# Altium schematic sheet SAM_E54_Xplained_Pro_CAN.SchDoc: CAN
size A3; Organization: ATMEL Norway; Address1: Vestre Rosten 79; Address2: N-7075 TILLER; Address3: NORWAY; DocumentNumber: A09-2748; Revision: 4; SheetNumber: 6; SheetTotal: 13; PageSetup: Record=PageOptions|CenterHorizontal=True|CenterVertical=True|PrintScale=1.01|XCorrection=1.00|YCorrection=1.00|PrintKind=1|BorderSize=5000000|LeftOffset=0|BottomOffset=0|Orientation=2|PaperLength=1000|PaperWidth=1000|Scale=100|PaperSource=7|PrintQuality=-4|MediaType=1|DitherType=10|PaperKind=A3 (297 x 420 mm)|PrintScaleMode=1; ProjectName: SAM3X Xplained Pro
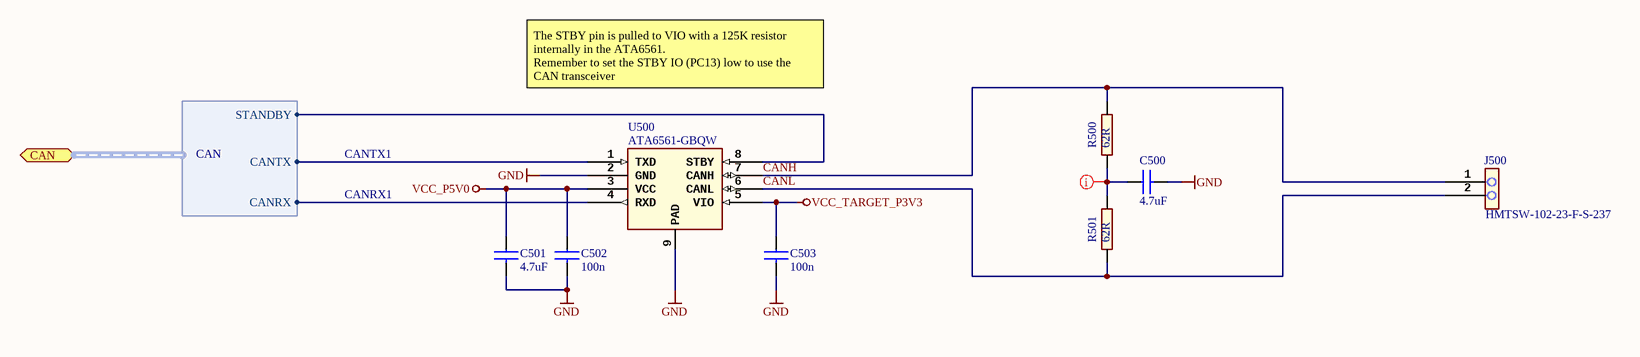
[diagram p0: SAM_E54_Xplained_Pro_CAN.SchDoc]

## Parts
C500  value 4.7uF  [AP1-00003]
C501  value 4.7uF  [AP1-00117]
C502  value 100n  [AP1-00001]
C503  value 100n  [AP1-00001]
J500  value HMTSW-102-23-F-S-237  [AP8-00733]
R500  value 62R  [AP2-00008]  (hidden comment: Generic component)
R501  value 62R  [AP2-00008]  (hidden comment: Generic component)
U500  value ATA6561-GBQW  [AP6-00407]

## Ports
CAN (harness CAN)

## Harnesses
CAN: CANTX, CANRX, STANDBY

## Nets
GND: C500.2 C501.2 C502.2 C503.2 U500.2(GND) U500.9(PAD)
VCC_P5V0: C501.1 C502.1 U500.3(VCC)
VCC_TARGET_P3V3: C503.1 U500.5(VIO)
CANH: J500.1 R500.2 U500.7(CANH)
CANL: J500.2 R501.1 U500.6(CANL)
NetC500_1: C500.1 R500.1 R501.2
NetU500_1: U500.1(TXD) ; port CAN.CANTX
NetU500_4: U500.4(RXD) ; port CAN.CANRX
NetU500_8: U500.8(STBY) ; port CAN.STANDBY

## Layout directives
rule Fabrication Testpoint Usage [Testpoint - Not Allowed    Multiple - Not Allowed]; rule Assembly Testpoint Usage [Testpoint - Not Allowed    Multiple - Not Allowed]: NetC500_1

## Notes on the sheet
- The STBY pin is pulled to VIO with a 125K resistor internally in the ATA6561.
  Remember to set the STBY IO (PC13) low to use the CAN transceiver
- CANTX1
- CANRX1
- Date:
- PAGE:
- of
- TITLE:
- Document number:
- Revision:

## Library data of the parts
C500 = A01-0400: Ceramic capacitor, SMD 0805, X5R, 25V, Â±10 %; PartGroup: Capacitors,Ceramic,SMD 0805; Manufacturer: Murata; MPN: GRM21BR61E475KA12L; Tolerance: Â±10%; AN: A01-0400; Height: 1,25
C501 = A01-0377: Ceramic capacitor, SMD 0603, X5R, 10V, 10% (de31036); PartGroup: Capacitors,Ceramic,SMD 0603; Manufacturer: WALSIN Technology Corporation; MPN: 0603X475K100CT; TemperatureRange: -55 - +85 deg C; AN: A01-0377; Tolerance: 10%; Height: 0,800000011920929
C502 C503 = A01-0246: Ceramic capacitor, SMD 0402, X7R, 16V, +/-10%; PartGroup: Capacitors,Ceramic,SMD 0402; Manufacturer: Kemet; MPN: C0402C104K4RACTU; TemperatureRange: -55 - +125 deg C; AN: A01-0246; Tolerance: 16V, +/-10%; Height: 0,5
J500 = A08-1754: 1x2 pin header, 2.54mm pitch, Pin-in-Paste THM; PartGroup: Mechanical devices,Connectors,Pin headers; Manufacturer: SAMTEC; TemperatureRange: - 55 deg C to + 125 deg C; AN: A08-1754; Height: 6,09999990463257; MPN: HMTSW-102-23-F-S-237
R500 R501 = A02-0760: Thick film resistor, SMD 1210, 0.5W, 1%; PartGroup: Resistors,SMD,1210 1%; Manufacturer: vishay; MPN: CRCW121062R0FKEAHP; TemperatureRange: -55°C to +155°C; AN: A02-0760; Tolerance: 1%; Height: 0,699999988079071
U500 = A06-1172: 5Mbit/s CAN Trasceiver,VCC = 5V, VIO = 2.8-5V, 3x3 mm VDFN8; PartGroup: Integrated Circuits,Interface ICs,CAN; Manufacturer: ATMEL; AN: A06-1172; Height: 0,899999976158142; MPN: ATA6561-GBQW